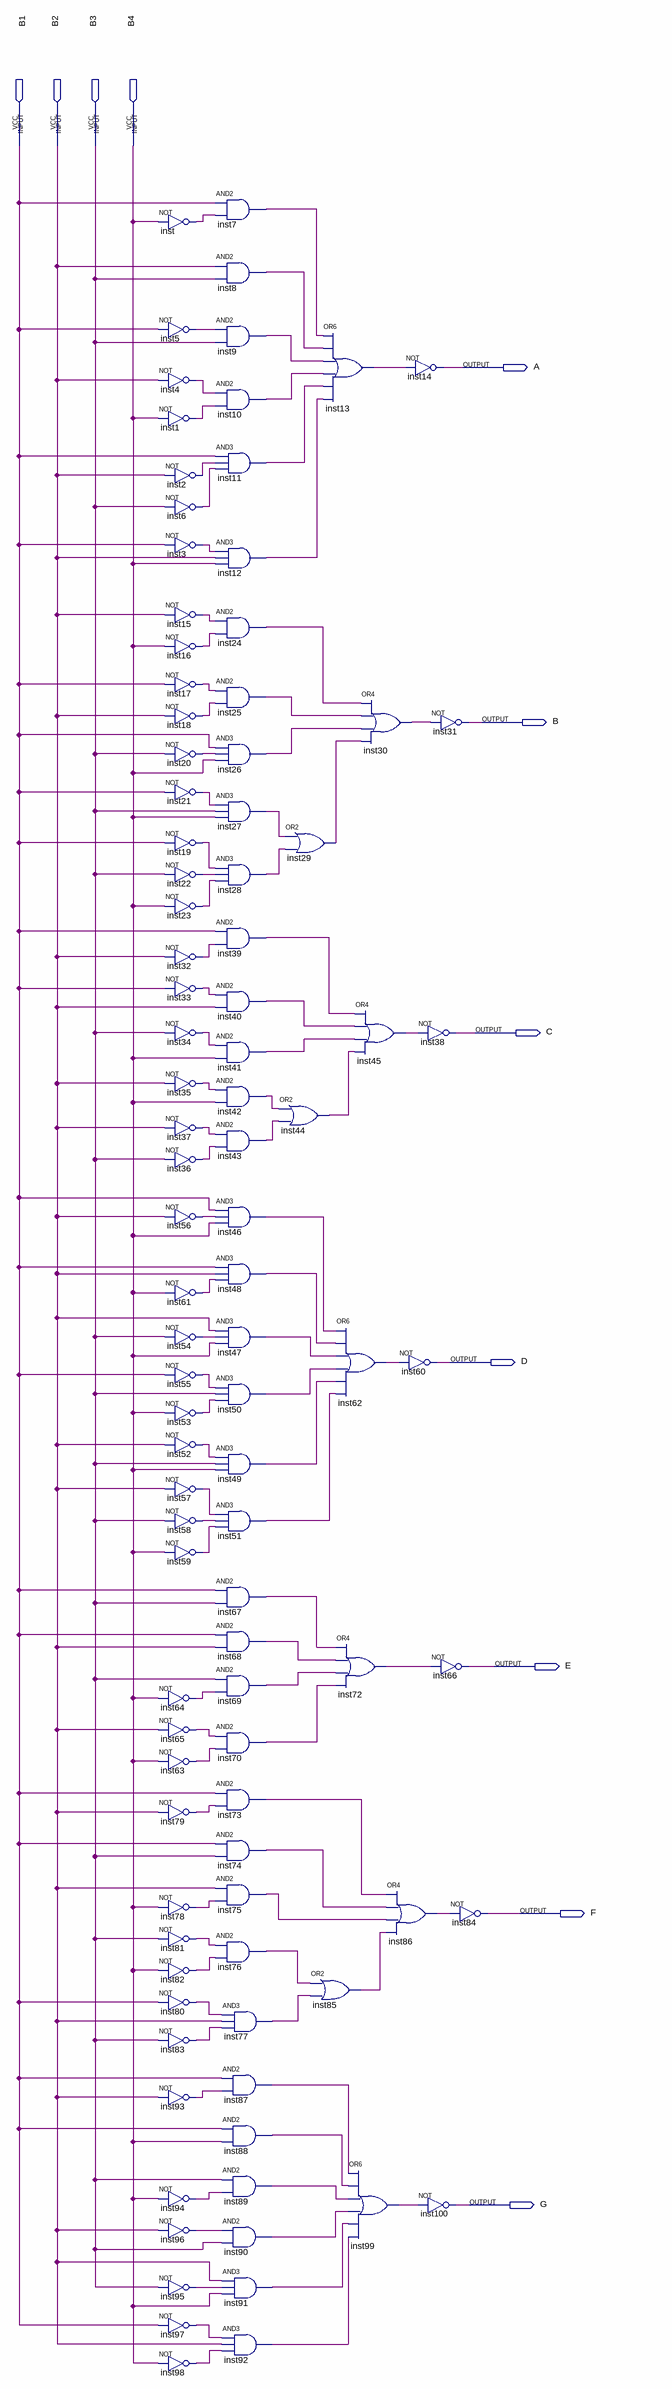
[diagram p0: schematic sheet]
// Quartus schematic display.bdf as structural Verilog: 100 symbols, 11 pins
module display (
  input  B1,
  input  B2,
  input  B3,
  input  B4,
  output A,
  output B,
  output C,
  output D,
  output E,
  output F,
  output G
);

  wire inst1_out, inst2_out, inst3_out, inst4_out, inst5_out, inst6_out, inst7_out, inst8_out, inst9_out,
       inst10_out, inst11_out, inst12_out, inst13_out, inst15_out, inst16_out, inst17_out, inst18_out,
       inst19_out, inst20_out, inst21_out, inst22_out, inst23_out, inst24_out, inst25_out, inst26_out,
       inst27_out, inst28_out, inst29_out, inst30_out, inst32_out, inst33_out, inst34_out, inst35_out,
       inst36_out, inst37_out, inst39_out, inst40_out, inst41_out, inst42_out, inst43_out, inst44_out,
       inst45_out, inst46_out, inst47_out, inst48_out, inst49_out, inst50_out, inst51_out, inst52_out,
       inst53_out, inst54_out, inst55_out, inst56_out, inst57_out, inst58_out, inst59_out, inst61_out,
       inst62_out, inst63_out, inst64_out, inst65_out, inst67_out, inst68_out, inst69_out, inst70_out,
       inst72_out, inst73_out, inst74_out, inst75_out, inst76_out, inst77_out, inst78_out, inst79_out,
       inst80_out, inst81_out, inst82_out, inst83_out, inst85_out, inst86_out, inst87_out, inst88_out,
       inst89_out, inst90_out, inst91_out, inst92_out, inst93_out, inst94_out, inst95_out, inst96_out,
       inst97_out, inst98_out, inst99_out, inst_out;

  not inst (inst_out, B4);
  not inst5 (inst5_out, B1);
  not inst4 (inst4_out, B2);
  not inst1 (inst1_out, B4);
  not inst2 (inst2_out, B2);
  not inst6 (inst6_out, B3);
  not inst3 (inst3_out, B1);
  not inst15 (inst15_out, B2);
  not inst16 (inst16_out, B4);
  not inst17 (inst17_out, B1);
  not inst18 (inst18_out, B2);
  not inst20 (inst20_out, B3);
  not inst21 (inst21_out, B1);
  not inst19 (inst19_out, B1);
  not inst22 (inst22_out, B3);
  not inst23 (inst23_out, B4);
  not inst32 (inst32_out, B2);
  not inst33 (inst33_out, B1);
  not inst34 (inst34_out, B3);
  not inst35 (inst35_out, B2);
  not inst37 (inst37_out, B2);
  not inst36 (inst36_out, B3);
  not inst56 (inst56_out, B2);
  not inst61 (inst61_out, B4);
  not inst54 (inst54_out, B3);
  not inst55 (inst55_out, B1);
  not inst53 (inst53_out, B4);
  not inst52 (inst52_out, B2);
  not inst57 (inst57_out, B2);
  not inst58 (inst58_out, B3);
  not inst59 (inst59_out, B4);
  not inst64 (inst64_out, B4);
  not inst65 (inst65_out, B2);
  not inst63 (inst63_out, B4);
  not inst79 (inst79_out, B2);
  not inst78 (inst78_out, B4);
  not inst81 (inst81_out, B3);
  not inst82 (inst82_out, B4);
  not inst80 (inst80_out, B1);
  not inst83 (inst83_out, B3);
  not inst93 (inst93_out, B2);
  not inst94 (inst94_out, B4);
  not inst96 (inst96_out, B2);
  not inst95 (inst95_out, B3);
  not inst97 (inst97_out, B1);
  not inst98 (inst98_out, B4);
  and inst7 (inst7_out, B1, inst_out);
  and inst8 (inst8_out, B2, B3);
  and inst9 (inst9_out, inst5_out, B3);
  and inst10 (inst10_out, inst4_out, inst1_out);
  and inst11 (inst11_out, B1, inst2_out, inst6_out);
  and inst12 (inst12_out, inst3_out, B2, B4);
  and inst24 (inst24_out, inst15_out, inst16_out);
  and inst25 (inst25_out, inst17_out, inst18_out);
  and inst26 (inst26_out, B1, inst20_out, B4);
  and inst27 (inst27_out, inst21_out, B3, B4);
  and inst28 (inst28_out, inst19_out, inst22_out, inst23_out);
  and inst39 (inst39_out, B1, inst32_out);
  and inst40 (inst40_out, inst33_out, B2);
  and inst41 (inst41_out, inst34_out, B4);
  and inst42 (inst42_out, inst35_out, B4);
  and inst43 (inst43_out, inst37_out, inst36_out);
  and inst46 (inst46_out, B1, inst56_out, B4);
  and inst48 (inst48_out, B1, B2, inst61_out);
  and inst47 (inst47_out, B2, inst54_out, B4);
  and inst50 (inst50_out, inst55_out, B3, inst53_out);
  and inst49 (inst49_out, inst52_out, B3, B4);
  and inst51 (inst51_out, inst57_out, inst58_out, inst59_out);
  and inst67 (inst67_out, B1, B3);
  and inst68 (inst68_out, B1, B2);
  and inst69 (inst69_out, B3, inst64_out);
  and inst70 (inst70_out, inst65_out, inst63_out);
  and inst73 (inst73_out, B1, inst79_out);
  and inst74 (inst74_out, B1, B3);
  and inst75 (inst75_out, B2, inst78_out);
  and inst76 (inst76_out, inst81_out, inst82_out);
  and inst77 (inst77_out, inst80_out, B2, inst83_out);
  and inst87 (inst87_out, B1, inst93_out);
  and inst88 (inst88_out, B1, B4);
  and inst89 (inst89_out, B3, inst94_out);
  and inst90 (inst90_out, inst96_out, B3);
  and inst91 (inst91_out, B2, inst95_out, B4);
  and inst92 (inst92_out, inst97_out, B2, inst98_out);
  or inst44 (inst44_out, inst42_out, inst43_out);
  or inst13 (inst13_out, inst7_out, inst8_out, inst9_out, inst10_out, inst11_out, inst12_out);
  or inst29 (inst29_out, inst27_out, inst28_out);
  or inst85 (inst85_out, inst76_out, inst77_out);
  or inst30 (inst30_out, inst24_out, inst25_out, inst26_out, inst29_out);
  or inst45 (inst45_out, inst39_out, inst40_out, inst41_out, inst44_out);
  or inst62 (inst62_out, inst46_out, inst48_out, inst47_out, inst50_out, inst49_out, inst51_out);
  or inst72 (inst72_out, inst67_out, inst68_out, inst69_out, inst70_out);
  or inst99 (inst99_out, inst87_out, inst88_out, inst89_out, inst90_out, inst91_out, inst92_out);
  not inst14 (A, inst13_out);
  not inst31 (B, inst30_out);
  not inst38 (C, inst45_out);
  not inst60 (D, inst62_out);
  not inst66 (E, inst72_out);
  or inst86 (inst86_out, inst73_out, inst74_out, inst75_out, inst85_out);
  not inst100 (G, inst99_out);
  not inst84 (F, inst86_out);
endmodule
